# Altium schematic sheet mpu9250.SchDoc: MJVESC - IMU
size A4; Author: Dongil Choi; Organization: NAVER LABS Corp.; Address1: Engineering Building 1, #214; Address2: 116 Myongji-ro, Cheoin-Gu; Address3: Yongin-si, Gyeonggi-Do; Address4: South Korea, 17058; DocumentNumber: 3; Revision: 0.2; SheetNumber: 5; SheetTotal: 5
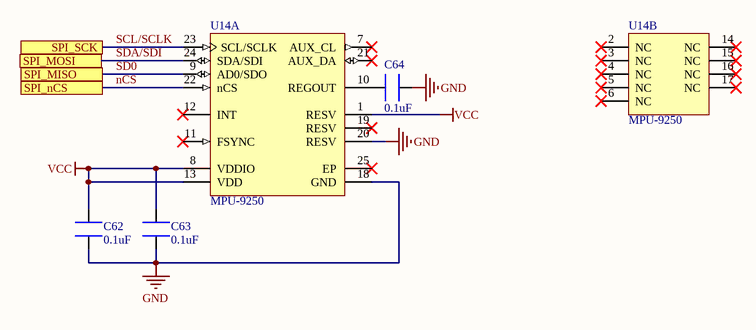
[diagram p0: mpu9250.SchDoc]

## Parts
C62  0.1uF  [CAP 0603/1608]
C63  0.1uF  [CAP 0603/1608]
C64  0.1uF  [CAP 0603/1608]
U14  MPU-9250  [INSE-QFN-24-1700X1540TP_L]  (parts A,B of 2)

## Ports
SPI_MISO, SPI_MOSI, SPI_nCS, SPI_SCK

## Nets
GND: C62.2 C63.2 C64.1 U14.18(GND) U14.20(RESV)
VCC: C62.1 C63.1 U14.1(RESV) U14.8(VDDIO) U14.13(VDD)
nCS: U14.22(nCS) ; port SPI_nCS
SCL/SCLK: U14.23(SCL/SCLK) ; port SPI_SCK
SD0: U14.9(AD0/SDO) ; port SPI_MISO
SDA/SDI: U14.24(SDA/SDI) ; port SPI_MOSI
NetC64_2: C64.2 U14.10(REGOUT)

Not connected (* = marked no-connect by the designer): U14 2(NC)* 3(NC)* 4(NC)* 5(NC)* 6(NC)* 7(AUX_CL)* 11(FSYNC)* 12(INT)* 14(NC)* 15(NC)* 16(NC)* 17(NC)* 19(RESV)* 21(AUX_DA)* 25(EP)*

## Notes on the sheet
- Title
- Size:
- Date:
- A4
- Number:
- Time:
- Revision:
- Sheet
- Author:
- of
- File:

## Library data of the parts
C62-C64 = GRM188R71E104KA01D: CAP CER 0.1UF 25V X7R 0603; PartNumber: GRM188R71E104KA01D
U14 = CMP-2100-03657-1: 9-axis MotionTracking device, 2.4 to 3,6 V, -40 to 85 degC, 24-Pin QFN, RoHS, Tape and Reel; Manufacturer: InvenSense; Max Supply Voltage: 3.6V; Min Supply Voltage: 2.4V; Package Reference: QFN-24; Package Quantity: 1; Datasheet Version: Rev. 1.0, 01/2014; Case/Package: QFN; Package Description: 24-Pin Quad Flat No-lead Package, Body 3 x 3 mm, Pitch 0.4 mm; Datasheet URL: http://datasheet.octopart.com/MPU-9250-InvenSense-datasheet-21859386.pdf; RoHSCompliant: true; Max Operating Temperature: 85degC; Height: 1mm; Mount: SurfaceMount; Manufacturer URL: http://www.invensense.com/; Width: 3.1mm; Min Operating Temperature: -40degC; Length: 3.1mm; PartNumber: MPU-9250